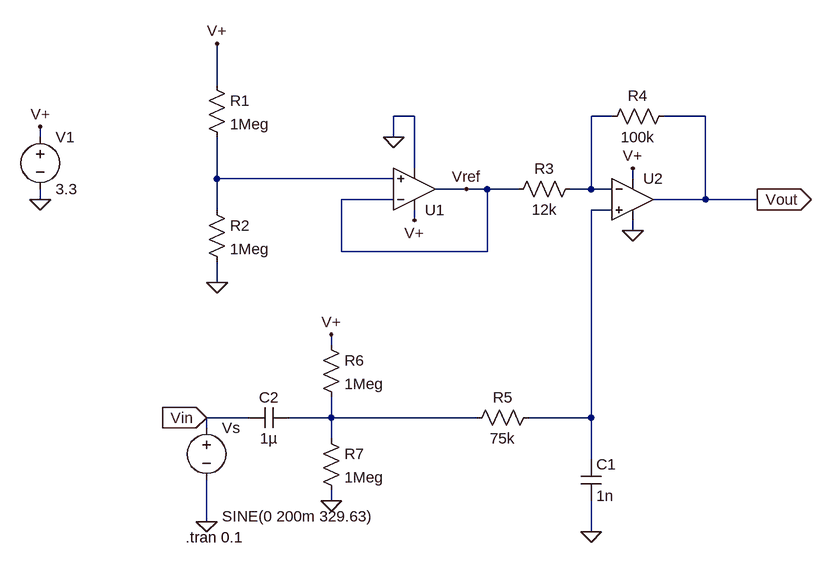
[diagram p0: schematic guitar_tuner_preamp.asc]
guitar_tuner_preamp.asc, the LTspice schematic file:
Version 4
SHEET 1 1520 760
WIRE 544 48 544 -16
WIRE 848 96 816 96
WIRE 1152 96 1120 96
WIRE 1296 96 1232 96
WIRE 272 128 272 112
WIRE 816 128 816 96
WIRE 848 176 848 96
WIRE 544 192 544 128
WIRE 816 192 544 192
WIRE 1184 192 1184 176
WIRE 928 208 880 208
WIRE 960 208 928 208
WIRE 1008 208 960 208
WIRE 1120 208 1120 96
WIRE 1120 208 1088 208
WIRE 1152 208 1120 208
WIRE 272 224 272 208
WIRE 816 224 736 224
WIRE 1296 224 1296 96
WIRE 1296 224 1216 224
WIRE 1376 224 1296 224
WIRE 544 240 544 192
WIRE 1152 240 1120 240
WIRE 848 256 848 240
WIRE 1184 272 1184 256
WIRE 736 304 736 224
WIRE 960 304 960 208
WIRE 960 304 736 304
WIRE 544 352 544 320
WIRE 720 448 720 432
WIRE 592 560 528 560
WIRE 720 560 720 528
WIRE 720 560 656 560
WIRE 944 560 720 560
WIRE 1120 560 1120 240
WIRE 1120 560 1024 560
WIRE 528 576 528 560
WIRE 720 592 720 560
WIRE 1120 624 1120 560
WIRE 720 688 720 672
WIRE 528 720 528 656
WIRE 1120 736 1120 688
FLAG 528 720 0
FLAG 272 224 0
FLAG 272 112 V+
FLAG 544 352 0
FLAG 544 -16 V+
FLAG 848 256 V+
FLAG 816 128 0
FLAG 1120 736 0
FLAG 1184 176 V+
FLAG 1184 272 0
FLAG 1376 224 Vout
IOPIN 1376 224 Out
FLAG 928 208 Vref
FLAG 720 688 0
FLAG 720 432 V+
FLAG 528 560 Vin
IOPIN 528 560 In
SYMBOL voltage 528 560 R0
WINDOW 3 24 152 Left 2
WINDOW 123 24 44 Left 2
WINDOW 39 0 0 Left 0
SYMATTR Value SINE(0 200m 329.63)
SYMATTR InstName Vs
SYMBOL voltage 272 112 R0
WINDOW 123 0 0 Left 0
WINDOW 39 0 0 Left 0
SYMATTR InstName V1
SYMATTR Value 3.3
SYMBOL res 528 32 R0
SYMATTR InstName R1
SYMATTR Value 1Meg
SYMBOL res 528 224 R0
SYMATTR InstName R2
SYMATTR Value 1Meg
SYMBOL Opamps\\UniversalOpAmp 848 208 M180
SYMATTR InstName U1
SYMBOL Opamps\\UniversalOpAmp 1184 224 R0
SYMATTR InstName U2
SYMBOL res 1104 192 R90
WINDOW 0 0 56 VBottom 2
WINDOW 3 32 56 VTop 2
SYMATTR InstName R3
SYMATTR Value 12k
SYMBOL res 1248 80 R90
WINDOW 0 0 56 VBottom 2
WINDOW 3 32 56 VTop 2
SYMATTR InstName R4
SYMATTR Value 100k
SYMBOL cap 1104 624 R0
SYMATTR InstName C1
SYMATTR Value 1n
SYMBOL res 1040 544 R90
WINDOW 0 0 56 VBottom 2
WINDOW 3 32 56 VTop 2
SYMATTR InstName R5
SYMATTR Value 75k
SYMBOL res 704 432 R0
SYMATTR InstName R6
SYMATTR Value 1Meg
SYMBOL res 704 576 R0
SYMATTR InstName R7
SYMATTR Value 1Meg
SYMBOL cap 656 544 R90
WINDOW 0 0 32 VBottom 2
WINDOW 3 32 32 VTop 2
SYMATTR InstName C2
SYMATTR Value 1µ
TEXT 496 744 Left 2 !.tran 0.1

The netlist it stands for:
* guitar_tuner_preamp.asc
Vs Vin 0 SINE(0 200m 329.63)
V1 V+ 0 3.3
R1 V+ N002 1Meg
R2 N002 0 1Meg
XU1 N002 Vref V+ 0 Vref level1 Avol=1Meg GBW=10Meg Vos=0 En=0 Enk=0 In=0 Ink=0 Rin=500Meg  ; pins In+ In- V+ V- OUT
XU2 N003 N001 V+ 0 Vout level1 Avol=1Meg GBW=10Meg Vos=0 En=0 Enk=0 In=0 Ink=0 Rin=500Meg  ; pins In+ In- V+ V- OUT
R3 N001 Vref 12k
R4 Vout N001 100k
C1 N003 0 1n
R5 N003 N004 75k
R6 V+ N004 1Meg
R7 N004 0 1Meg
C2 N004 Vin 1µ
.tran 0.1
.lib UniversalOpAmp1.lib
.backanno
.end